# Altium schematic sheet reallun.SchDoc
size 254 x 635 mm; SheetNumber: 1; SheetTotal: 1
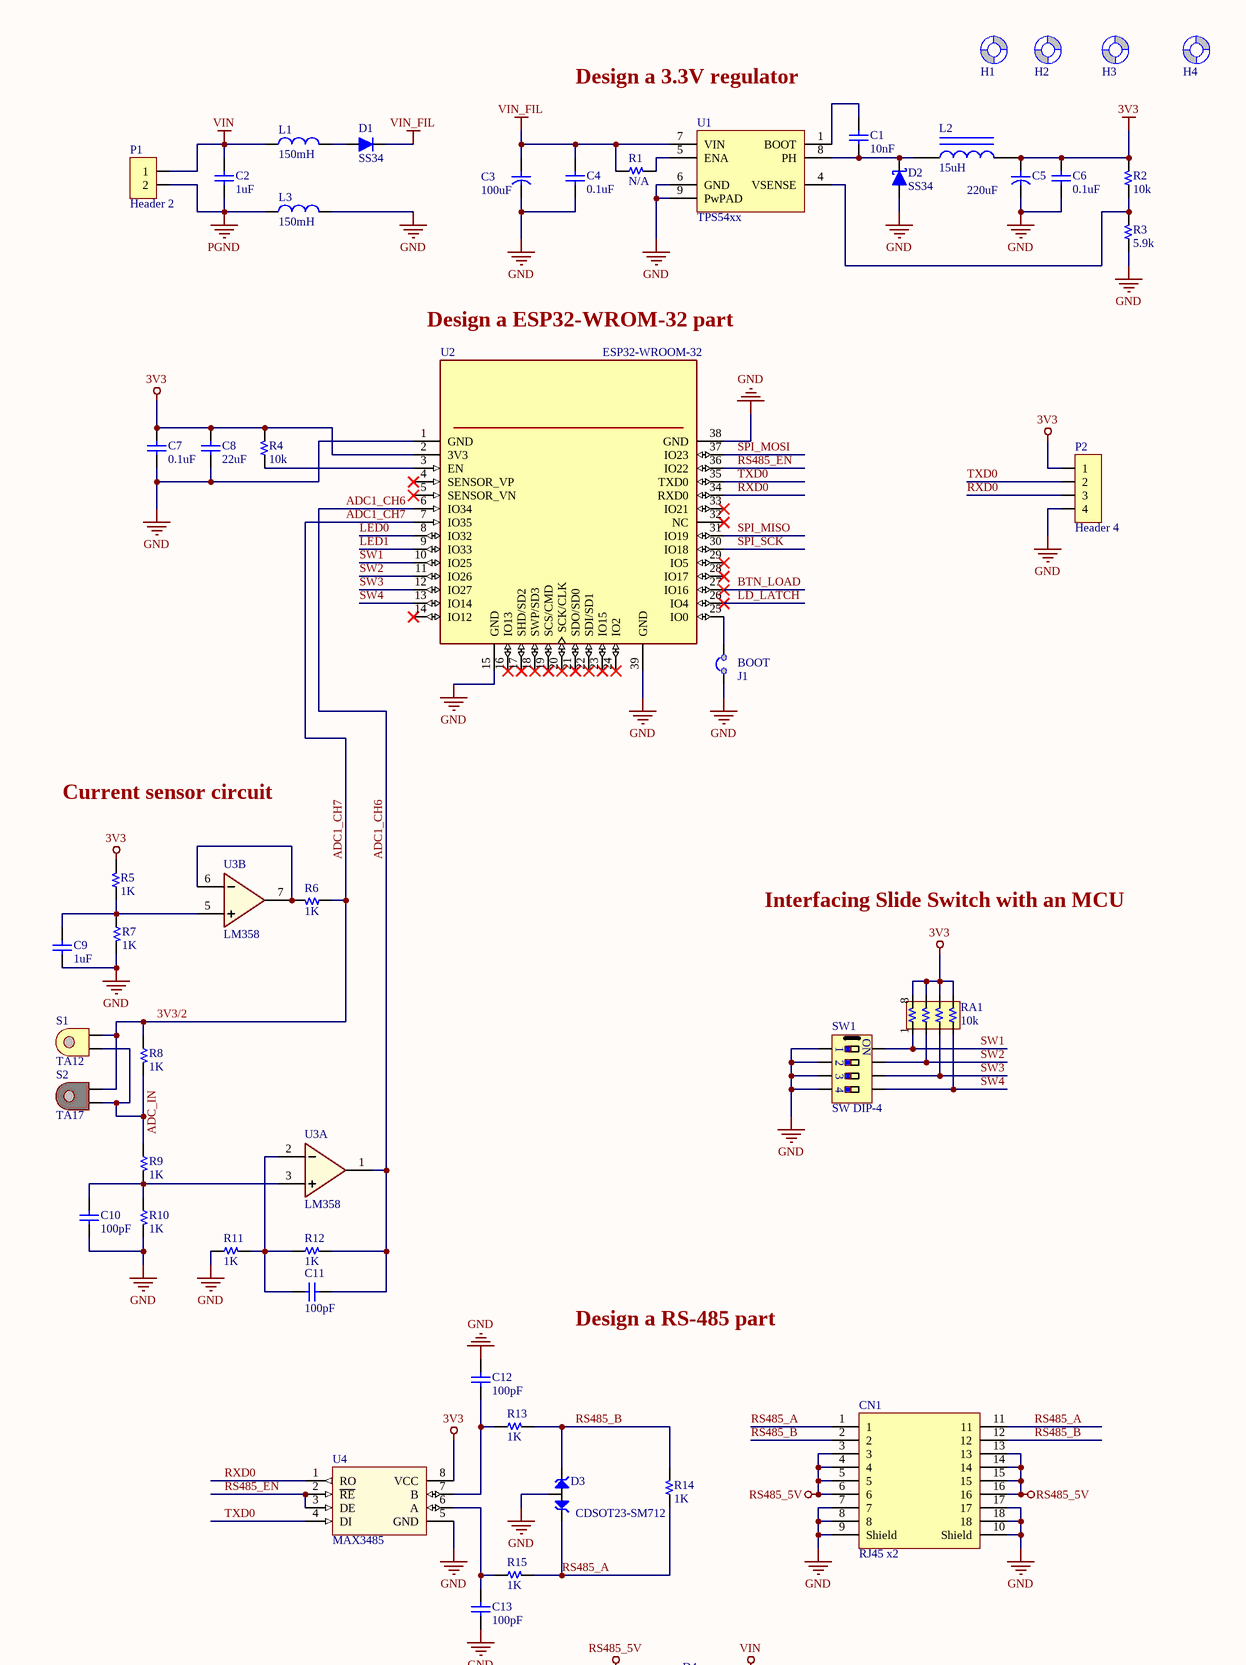
[diagram p0: reallun.SchDoc, top]
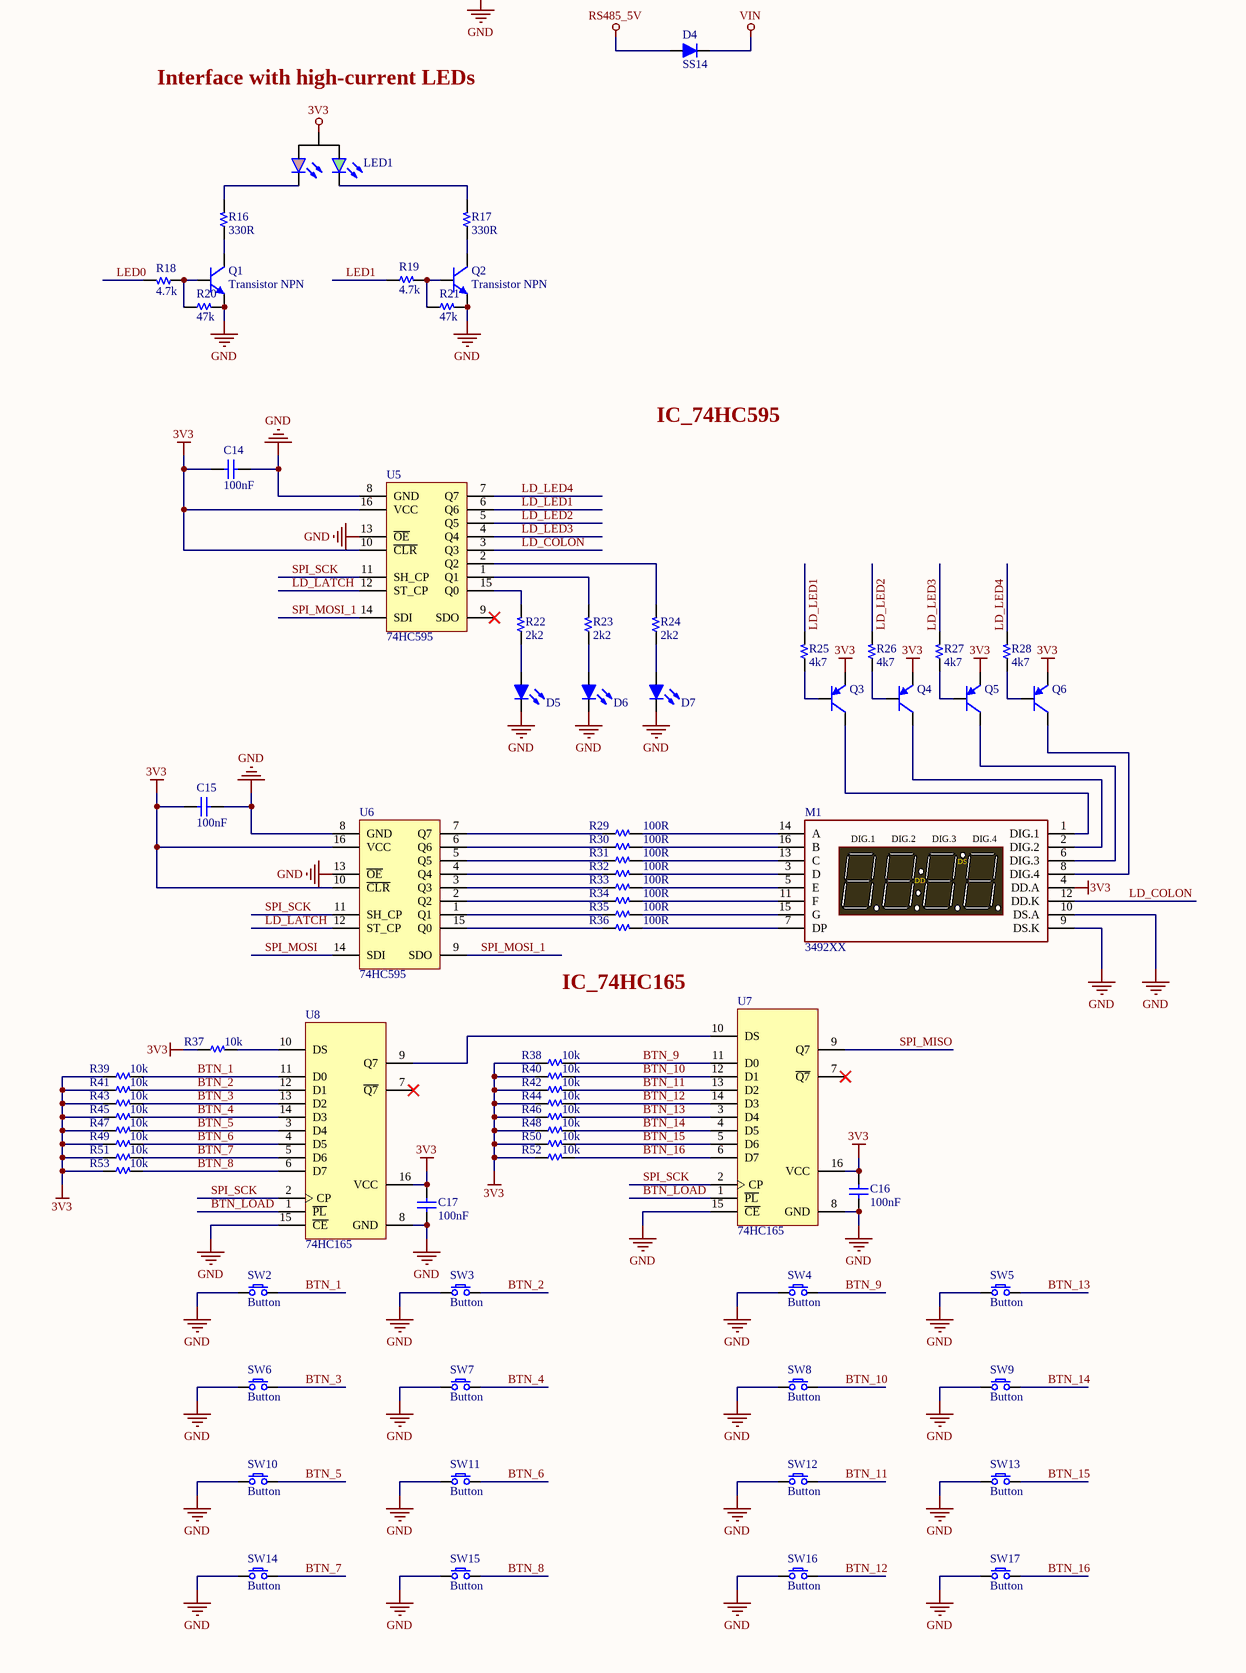
[diagram p1: reallun.SchDoc, bottom]

## Parts
C1  10nF  [C 0805]
C2  1uF  [C 0805]
C3  100uF  [C SMD TAN 1206 (A)]
C4  0.1uF  [C 0805]
C5  220uF  [C SMD TAN 1206 (A)]
C6  0.1uF  [C 0805]
C7  0.1uF  [C 0805]
C8  22uF  [C 0805]
C9  1uF  [C 0805]
C10  100pF  [C 0805]
C11  100pF  [C 0805]
C12  100pF  [C 0805]
C13  100pF  [C 0805]
C14  100nF  [C 0805]
C15  100nF  [C 0805]
C16  100nF  [C 0805]
C17  100nF  [C 0805]
CN1  RJ45 x2  [CONN/RJ45/x2]
D1  SS34  [DO-35 (SOD27 )]
D2  SS34  [DO-41]
D3  CDSOT23-SM712  [SOT-23]
D4  SS14  [DO-35 (SOD27 )]
D5  Led  [Led 0805]  (value not drawn)
D6  Led  [Led 0805]  (value not drawn)
D7  Led  [Led 0805]  (value not drawn)
H1  Screw Hole  [SCREW/3.2/7.0/M]  (value not drawn)  (no BOM)
H2  Screw Hole  [SCREW/3.2/7.0/M]  (value not drawn)  (no BOM)
H3  Screw Hole  [SCREW/3.2/7.0/M]  (value not drawn)  (no BOM)
H4  Screw Hole  [SCREW/3.2/7.0/M]  (value not drawn)  (no BOM)
J1  BOOT  [JUMP/2/Close]  (no BOM)
L1  150mH  [Inductor SMD 0805 (2012)]
L2  value 15uH  [Inductor SMD 4.8x4.8]  (hidden comment: Inductor Iron)
L3  150mH  [Inductor SMD 0805 (2012)]
LED1  Led 3pin 2color  [LED 3PIN 2COLOR 5MM]  (value not drawn)
M1  3492XX  [LED 7-SEG X4 3492XX]
P1  Header 2  [HDR/Header/2]
P2  Header 4  [HDR/Header/4]
Q1  Transistor NPN  [SOT-23]
Q2  Transistor NPN  [SOT-23]
Q3  Transistor PNP  [SOT-23]  (value not drawn)
Q4  Transistor PNP  [SOT-23]  (value not drawn)
Q5  Transistor PNP  [SOT-23]  (value not drawn)
Q6  Transistor PNP  [SOT-23]  (value not drawn)
R1  N/A  [R 0805]
R2  10k  [R 0805]
R3  5.9k  [R 0805]
R4  10k  [R 0805]
R5  1K  [R 0805]
R6  1K  [R 0805]
R7  1K  [R 0805]
R8  1K  [R 0805]
R9  1K  [R 0805]
R10  1K  [R 0805]
R11  1K  [R 0805]
R12  1K  [R 0805]
R13  1K  [R 0805]
R14  1K  [R 0805]
R15  1K  [R 0805]
R16  330R  [R 0805]
R17  330R  [R 0805]
R18  4.7k  [R 0805]
R19  4.7k  [R 0805]
R20  47k  [R 0805]
R21  47k  [R 0805]
R22  2k2  [R 0805]
R23  2k2  [R 0805]
R24  2k2  [R 0805]
R25  4k7  [R 0805]
R26  4k7  [R 0805]
R27  4k7  [R 0805]
R28  4k7  [R 0805]
R29  100R  [R 0805]
R30  100R  [R 0805]
R31  100R  [R 0805]
R32  100R  [R 0805]
R33  100R  [R 0805]
R34  100R  [R 0805]
R35  100R  [R 0805]
R36  100R  [R 0805]
R37  10k  [R 0805]
R38  10k  [R 0805]
R39  10k  [R 0805]
R40  10k  [R 0805]
R41  10k  [R 0805]
R42  10k  [R 0805]
R43  10k  [R 0805]
R44  10k  [R 0805]
R45  10k  [R 0805]
R46  10k  [R 0805]
R47  10k  [R 0805]
R48  10k  [R 0805]
R49  10k  [R 0805]
R50  10k  [R 0805]
R51  10k  [R 0805]
R52  10k  [R 0805]
R53  10k  [R 0805]
RA1  10k  [RA4 1206 (3216)]
S1  TA12  [TA12]
S2  TA17  [TA17]
SW1  SW DIP-4  [SW/DIP4]
SW2  Button  [SW/2/DIP]
SW3  Button  [SW/2/DIP]
SW4  Button  [SW/2/DIP]
SW5  Button  [SW/2/DIP]
SW6  Button  [SW/2/DIP]
SW7  Button  [SW/2/DIP]
SW8  Button  [SW/2/DIP]
SW9  Button  [SW/2/DIP]
SW10  Button  [SW/2/DIP]
SW11  Button  [SW/2/DIP]
SW12  Button  [SW/2/DIP]
SW13  Button  [SW/2/DIP]
SW14  Button  [SW/2/DIP]
SW15  Button  [SW/2/DIP]
SW16  Button  [SW/2/DIP]
SW17  Button  [SW/2/DIP]
U1  TPS54xx  [SOIC-8 EP]
U2  ESP32-WROOM-32  [MODULE_ESP32-WROOM-32]
U3  LM358  [SOIC-8]  (parts A,B of 2)
U4  MAX3485  [SOIC-8]
U5  74HC595  [SOIC-16]
U6  74HC595  [SOIC-16]
U7  74HC165  [TSSOP16]
U8  74HC165  [TSSOP16]

## Nets
3V3: C5.1 C6.1 C7.1 C8.1 C14.1 C15.1 C16.1 C17.1 L2.2 LED1.2(A) M1.4(DD.A) P2.1 Q3.2(E) Q4.2(E) Q5.2(E) Q6.2(E) R2.2 R4.2 R5.2 R37.1 R38.1 R39.1 R40.1 R41.1 R42.1 R43.1 R44.1 R45.1 R46.1 R47.1 R48.1 R49.1 R50.1 R51.1 R52.1 R53.1 RA1.5 RA1.6 RA1.7 RA1.8 U2.2(3V3) U4.8(VCC) U5.10(~{CLR}) U5.16(VCC) U6.10(~{CLR}) U6.16(VCC) U7.16(VCC) U8.16(VCC)
GND: C3.2 C4.2 C5.2 C6.2 C7.2 C8.2 C9.2 C10.2 C12.1 C13.2 C14.2 C15.2 C16.2 C17.2 CN1.7 CN1.8 CN1.9(Shield) CN1.10(Shield) CN1.17 CN1.18 D2.1(A) D3.3(COM) D5.2(K) D6.2(K) D7.2(K) J1.1 L3.2 M1.9(DS.K) M1.10(DS.A) P2.4 Q1.2(E) Q2.2(E) R3.1 R7.2 R10.2 R11.1 R20.2 R21.2 SW1.1 SW1.2 SW1.3 SW1.4 SW2.1 SW3.1 SW4.1 SW5.1 SW6.1 SW7.1 SW8.1 SW9.1 SW10.1 SW11.1 SW12.1 SW13.1 SW14.1 SW15.1 SW16.1 SW17.1 U1.6(GND) U1.9(PwPAD) U2.1(GND) U2.15(GND) U2.38(GND) U2.39(GND) U3.4(GND) U4.5(GND) U5.8(GND) U5.13(~{OE}) U6.8(GND) U6.13(~{OE}) U7.8(GND) U7.15(~{CE}) U8.8(GND) U8.15(~{CE})
PGND: C2.1 L3.1 P1.2
RS485_5V: CN1.3 CN1.4 CN1.5 CN1.6 CN1.13 CN1.14 CN1.15 CN1.16 D4.1(A)
VCC: U3.8(VCC)
VIN: C2.2 D4.2(K) L1.1 P1.1
VIN_FIL: C3.1 C4.1 D1.2(K) R1.1 U1.7(VIN)
ADC1_CH6: C11.1 R12.2 U2.6(IO34) U3.1(OutA)
ADC1_CH7: R6.1 R8.1 S1.2 S2.2 U2.7(IO35)
ADC_IN: R8.2 R9.1 S1.1 S2.1
BTN_1: R39.2 SW2.2 U8.11(D0)
BTN_2: R41.2 SW3.2 U8.12(D1)
BTN_3: R43.2 SW6.2 U8.13(D2)
BTN_4: R45.2 SW7.2 U8.14(D3)
BTN_5: R47.2 SW10.2 U8.3(D4)
BTN_6: R49.2 SW11.2 U8.4(D5)
BTN_7: R51.2 SW14.2 U8.5(D6)
BTN_8: R53.2 SW15.2 U8.6(D7)
BTN_9: R38.2 SW4.2 U7.11(D0)
BTN_10: R40.2 SW8.2 U7.12(D1)
BTN_11: R42.2 SW12.2 U7.13(D2)
BTN_12: R44.2 SW16.2 U7.14(D3)
BTN_13: R46.2 SW5.2 U7.3(D4)
BTN_14: R48.2 SW9.2 U7.4(D5)
BTN_15: R50.2 SW13.2 U7.5(D6)
BTN_16: R52.2 SW17.2 U7.6(D7)
BTN_LOAD: U2.27(IO16) U7.1(~{PL}) U8.1(~{PL})
LD_COLON: M1.12(DD.K) U5.3(Q3)
LD_LATCH: U2.26(IO4) U5.12(ST_CP) U6.12(ST_CP)
LD_LED1: R25.2 U5.6(Q6)
LD_LED2: R26.2 U5.5(Q5)
LD_LED3: R27.2 U5.4(Q4)
LD_LED4: R28.2 U5.7(Q7)
LED0: R18.2 U2.8(IO32)
LED1: R19.1 U2.9(IO33)
RS485_A: CN1.1 CN1.11 D3.1(IO1) R14.1 R15.2
RS485_B: CN1.2 CN1.12 D3.2(IO2) R13.2 R14.2
RS485_EN: U2.36(IO22) U4.2(~{RE}) U4.3(DE)
RXD0: P2.3 U2.34(RXD0) U4.1(RO)
SPI_MISO: U2.31(IO19) U7.9(Q7)
SPI_MOSI: U2.37(IO23) U6.14(SDI)
SPI_MOSI_1: U5.14(SDI) U6.9(SDO)
SPI_SCK: U2.30(IO18) U5.11(SH_CP) U6.11(SH_CP) U7.2(CP) U8.2(CP)
SW1: RA1.1 SW1.8 U2.10(IO25)
SW2: RA1.2 SW1.7 U2.11(IO26)
SW3: RA1.3 SW1.6 U2.12(IO27)
SW4: RA1.4 SW1.5 U2.13(IO14)
TXD0: P2.2 U2.35(TXD0) U4.4(DI)
NetC1_1: C1.1 U1.1(BOOT)
NetC1_2: C1.2 D2.2(K) L2.1 U1.8(PH)
NetC9_1: C9.1 R5.1 R7.1 U3.5(B+)
NetC10_1: C10.1 R9.2 R10.1 U3.3(A+)
NetC11_2: C11.2 R11.2 R12.1 U3.2(A-)
NetC12_2: C12.2 R13.1 U4.7(B)
NetC13_1: C13.1 R15.1 U4.6(A)
NetD1_1: D1.1(A) L1.2
NetD5_1: D5.1(A) R22.1
NetD6_1: D6.1(A) R23.1
NetD7_1: D7.1(A) R24.1
NetJ1_2: J1.2 U2.25(IO0)
NetLED1_1: LED1.1(RK) R16.2
NetLED1_3: LED1.3(YK) R17.2
NetM1_1: M1.1(DIG.1) Q3.3(C)
NetM1_2: M1.2(DIG.2) Q4.3(C)
NetM1_3: M1.3(D) R32.2
NetM1_5: M1.5(E) R33.2
NetM1_6: M1.6(DIG.3) Q5.3(C)
NetM1_7: M1.7(DP) R36.2
NetM1_8: M1.8(DIG.4) Q6.3(C)
NetM1_11: M1.11(F) R34.2
NetM1_13: M1.13(C) R31.2
NetM1_14: M1.14(A) R29.2
NetM1_15: M1.15(G) R35.2
NetM1_16: M1.16(B) R30.2
NetQ1_1: Q1.1(B) R18.1 R20.1
NetQ1_3: Q1.3(C) R16.1
NetQ2_1: Q2.1(B) R19.2 R21.1
NetQ2_3: Q2.3(C) R17.1
NetQ3_1: Q3.1(B) R25.1
NetQ4_1: Q4.1(B) R26.1
NetQ5_1: Q5.1(B) R27.1
NetQ6_1: Q6.1(B) R28.1
NetR1_2: R1.2 U1.5(ENA)
NetR2_1: R2.1 R3.2 U1.4(VSENSE)
NetR4_1: R4.1 U2.3(EN)
NetR6_2: R6.2 U3.6(B-) U3.7(OutB)
NetR22_2: R22.2 U5.15(Q0)
NetR23_2: R23.2 U5.1(Q1)
NetR24_2: R24.2 U5.2(Q2)
NetR29_1: R29.1 U6.7(Q7)
NetR30_1: R30.1 U6.6(Q6)
NetR31_1: R31.1 U6.5(Q5)
NetR32_1: R32.1 U6.4(Q4)
NetR33_1: R33.1 U6.3(Q3)
NetR34_1: R34.1 U6.2(Q2)
NetR35_1: R35.1 U6.1(Q1)
NetR36_1: R36.1 U6.15(Q0)
NetR37_2: R37.2 U8.10(DS)
NetU7_10: U7.10(DS) U8.9(Q7)

Not connected (* = marked no-connect by the designer): H1 1(Screw); H2 1(Screw); H3 1(Screw); H4 1(Screw); U2 4(SENSOR_VP)* 5(SENSOR_VN)* 14(IO12)* 16(IO13)* 17(SHD/SD2)* 18(SWP/SD3)* 19(SCS/CMD)* 20(SCK/CLK)* 21(SDO/SD0)* 22(SDI/SD1)* 23(IO15)* 24(IO2)* 28(IO17)* 29(IO5)* 32(NC)* 33(IO21)*; U5 9(SDO)*; U7 7(~{Q7})*; U8 7(~{Q7})*

## Notes on the sheet
- Design a 3.3V regulator
- Design a ESP32-WROM-32 part
- Current sensor circuit
- Interfacing Slide Switch with an MCU
- (near R8) 3V3/2
- Design a RS-485 part
- Interface with high-current LEDs
- IC_74HC595
- IC_74HC165
- (in symbol LED 7-SEG X4 3492) DS; DD
- (in symbol SW DIP-4) ON

## Library data of the parts
C1 C2 C4 C6-C17 = Capacitor NP: Capacitor non-pol
C3 C5 = Capacitor: Capacitor pol
CN1 = CON RJ45 x2: Connector RJ45 X2
D1 D4 = Diode: Default Diode
D2 = Diode Schottky: Schottky Diode
D3 = CDSOT23-SM712: TVS DIODE 7V/12V 14V/26V SOT23-3
D5-D7 = Led: Typical LED
J1 = JUMP 2
L1 L3 = L1: Inductor; Value: 150 mH
L2 = Inductor Iron: Magnetic-Core Inductor; Published: 24-Mar-1999; LatestRevisionDate: 17-Jul-2002; LatestRevisionNote: Re-released for DXP Platform.; PackageReference: AXIAL-0.9; Publisher: Altium Limited; PackageDescription: Axial Device, Thru-Hole; 2 Leads; 0.9 in Pin Spacing
LED1 = Led 3pin 2color: Typical LED 3-pin 2-color
M1 = LED 7-SEG X4 3492: LED 7-seg x4 HDSP-B09G
P1 = Header 2: Header, 2-Pin
P2 = Header 4: Header, 4-Pin
Q1 Q2 = Transistor NPN: NPN Bipolar Transistor
Q3-Q6 = Transistor PNP: PNP Bipolar Transistor
R1-R53 = Resistor
RA1 = Resistor Array 4
SW2-SW17 = SW SPST: Tact switch 2 pin
U1 = TPS54xx: 3/5A, Wide input range, Step-down SWIFT DC-DC Converter
U2 = ESP32-WROOM-32: Bluetooth, WiFi 802.11b/g/n, Bluetooth v4.2 + EDR, Class 1, 2 and 3 Transceiver Module 2.4GHz ~ 2.5GHz Integrated, Trace Surface Mount; MF: Espressif Systems; MP: ESP32-WROOM-32D; Price: None; Package: Module Espressif Systems; Availability: Unavailable; SnapEDA_Link: https://www.snapeda.com/parts/ESP32-WROOM-32D/Espressif%20Systems/view-part/2768115/?ref=snap; Value: *
U3 = LM358: Low Power Dual Operational Amplifiers
U4 = MAX485: Low-Power, Slew-Rate-Limited  RS-485/RS-422 Transceivers
U5 U6 = 74HC595: 8-bit serial-in, serial or parallel-out  shift register with output latches;  3-state
U7 U8 = 74HC165: 8-Bit Parallel In/Serial Output Shift Register; ID: SN74HC165PWR; PDF: http://www.ti.com/lit/ds/symlink/sn74hc165.pdf; BUY_LINK: http://www.digikey.com/product-detail/en/SN74HC165PWR/296-8253-1-ND/376670; PRICE: 0.49000
H1-H4 = Screw Hole: TYPE: NO-BOM; UNIT PRICE: 0